# EAGLE design ESP-WROOM02-Breakout_v11 (EAGLE 7.7.0)
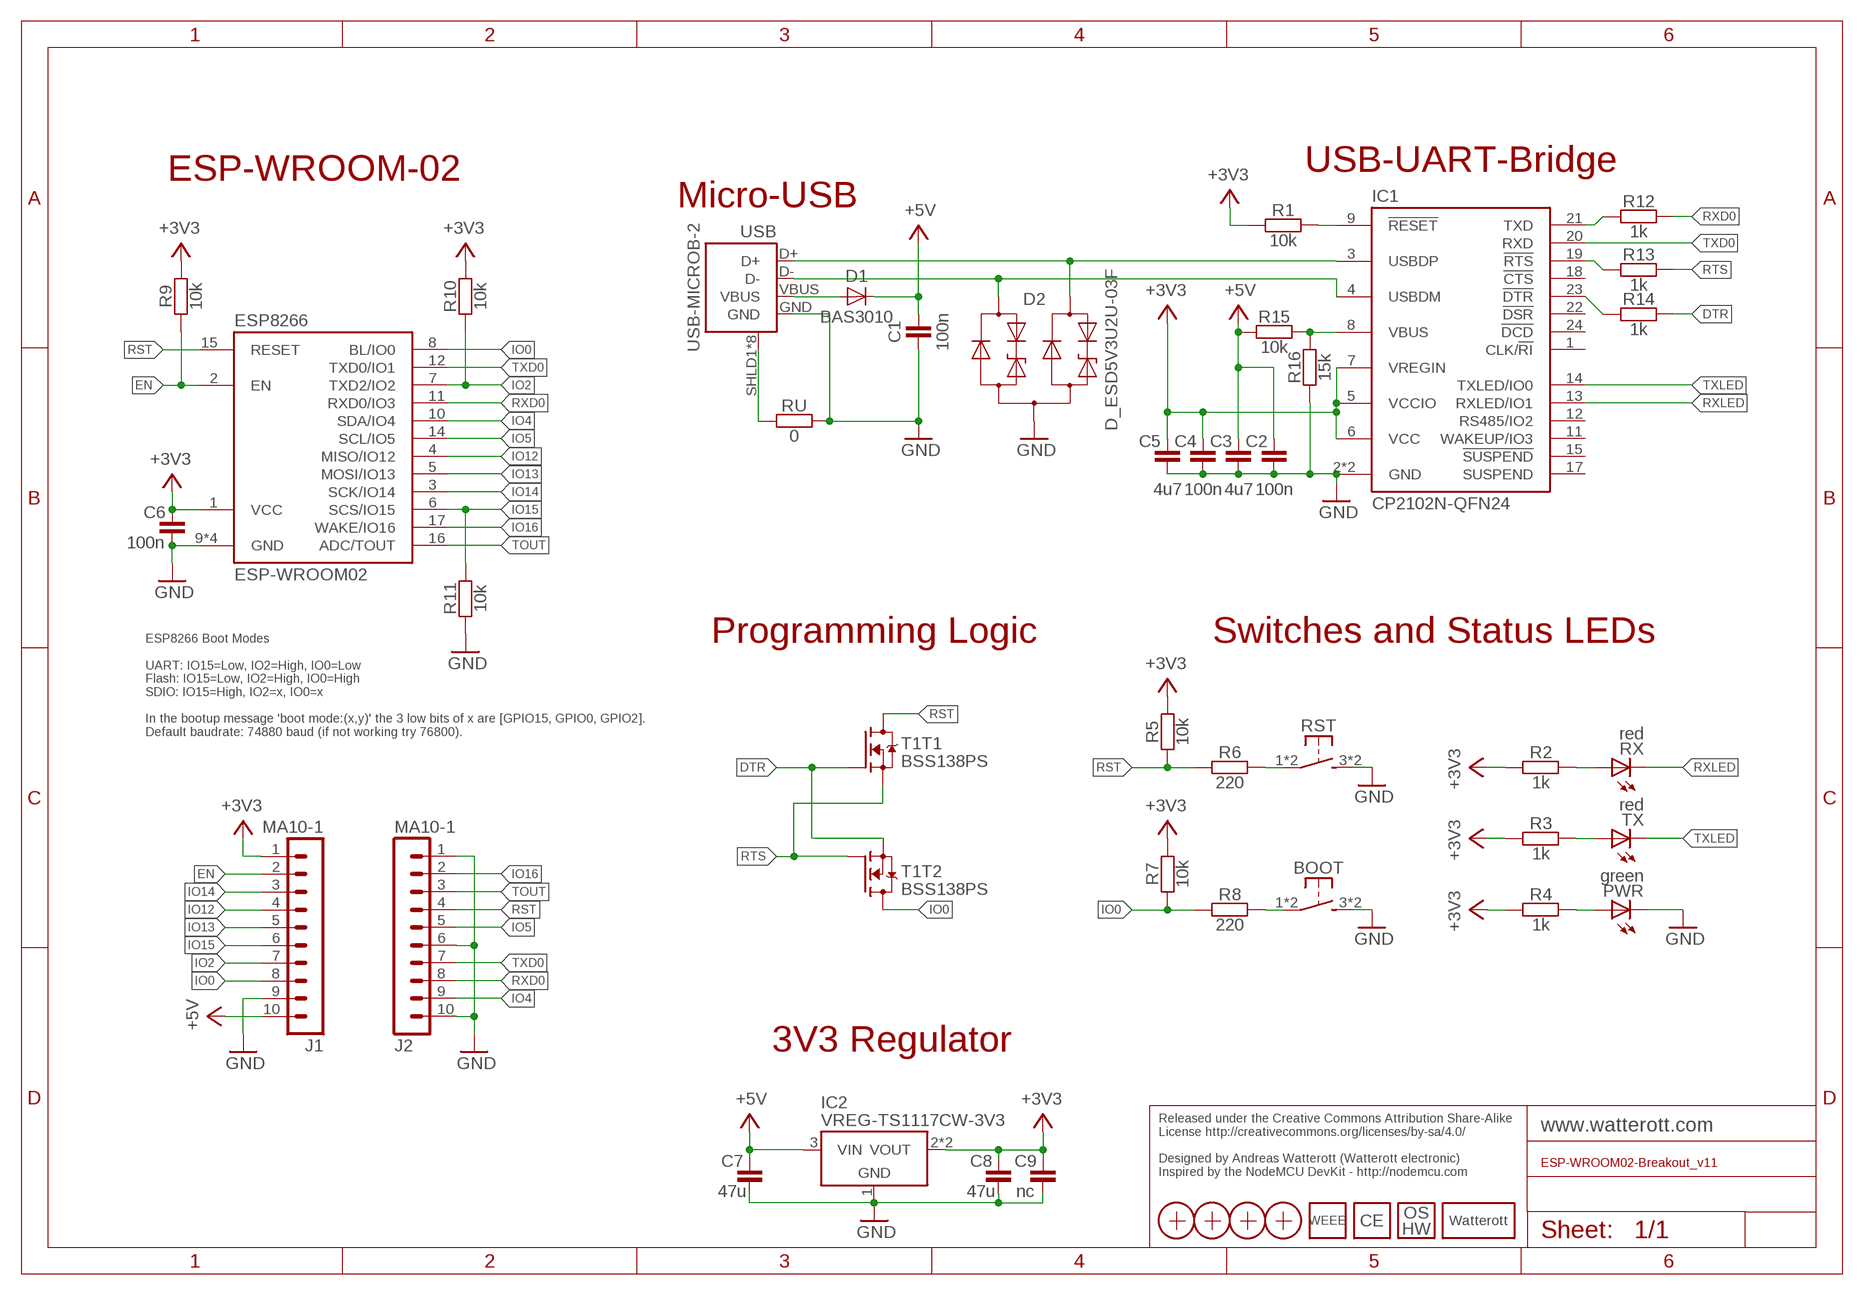
[diagram p0: schematic, sheet 1]

## Parts
BOOT  SW-TACTILE-PTS840P  [PTS840P]
C1  100n  CAPACITOR-0402  [C0402]
C2  100n  CAPACITOR-0402  [C0402]
C3  4u7  CAPACITOR-0603  [C0603]
C4  100n  CAPACITOR-0402  [C0402]
C5  4u7  CAPACITOR-0603  [C0603]
C6  100n  CAPACITOR-0402  [C0402]
C7  47u  CAPACITOR-1206  [C1206]
C8  47u  CAPACITOR-1206  [C1206]
C9  nc  CAPACITOR-1206  [C1206]
D1  BAS3010  DIODE-SOD323  [SOD323]
D2  D_ESD5V3U2U-03F  [SOT723]
ESP8266  ESP-WROOM02  [ESP-WROOM02]
IC1  CP2102N-QFN24  [QFN24-PAD]
IC2  VREG-TS1117CW-3V3  [SOT223]
J1  MA10-1  [MA10-1]
J2  MA10-1  [MA10-1]
LOGO1  LOGO_SPARK-4  [SPARK_4MM]
LOGO2  LOGO_OSHW-2  [OSHW_2MM]
LOGO3  LOGO_WEEE-4  [WEEE_4MM]
LOGO4  LOGO_CE-2  [CE_2MM]
PWR  green  LED-0603  [C0603]
R1  10k  RESISTOR-0402  [C0402]
R2  1k  RESISTOR-0402  [C0402]
R3  1k  RESISTOR-0402  [C0402]
R4  1k  RESISTOR-0402  [C0402]
R5  10k  RESISTOR-0402  [C0402]
R6  220  RESISTOR-0402  [C0402]
R7  10k  RESISTOR-0402  [C0402]
R8  220  RESISTOR-0402  [C0402]
R9  10k  RESISTOR-0402  [C0402]
R10  10k  RESISTOR-0402  [C0402]
R11  10k  RESISTOR-0402  [C0402]
R12  1k  RESISTOR-0402  [C0402]
R13  1k  RESISTOR-0402  [C0402]
R14  1k  RESISTOR-0402  [C0402]
R15  10k  RESISTOR-0402  [C0402]
R16  15k  RESISTOR-0402  [C0402]
RST  SW-TACTILE-PTS840P  [PTS840P]
RU  0  RESISTOR-0402  [C0402]
RX  red  LED-0603  [C0603]
T1  BSS138PS  [SOT363]
TX  red  LED-0603  [C0603]
USB  USB-MICROB-2  [USB-MICROB-10118194]
X1  PASSER-07  [PASSER_07MM]
X2  PASSER-07  [PASSER_07MM]
X3  PASSER-07  [PASSER_07MM]
X4  PASSER-07  [PASSER_07MM]

## Nets
+3V3: C4.2 C5.2 C6.2 C8.2 C9.2 ESP8266.1(VCC) IC1.5(VCCIO) IC1.6(VCC) IC1.7(VREGIN) IC2.2(VOUT) IC2.4(VOUT) J1.1 R1.1 R2.1 R3.1 R4.1 R5.2 R7.2 R9.2 R10.2
+5V: C1.2 C2.2 C3.2 C7.2 D1.C IC2.3(VIN) J1.10 R15.1
CP_VBUS: IC1.8(VBUS) R15.2 R16.2
CPDTR: IC1.23(!DTR) R14.1
CPRTS: IC1.19(!RTS) R13.1
CPTX: IC1.21(TXD) R12.1
D_N: D2.1(C1) IC1.4(USBDM) USB.D-
D_P: D2.2(C2) IC1.3(USBDP) USB.D+
DTR: R14.2 T1.2(T1:G) T1.4(T2:S)
EN: ESP8266.2(EN) J1.2 R9.1
GND: BOOT.3(S1) BOOT.4(S1) C1.1 C2.1 C3.1 C4.1 C5.1 C6.1 C7.1 C8.1 C9.1 D2.3(A) ESP8266.9(GND) ESP8266.13(GND) ESP8266.18(GND) ESP8266.TP(GND) IC1.2(GND) IC1.TP(GND) IC2.1(GND) J1.9 J2.1 J2.6 J2.10 PWR.C R11.1 R16.1 RST.3(S1) RST.4(S1) RU.2 USB.GND
IO0: ESP8266.8(BL/IO0) J1.8 R7.1 R8.1 T1.3(T2:D)
IO2: ESP8266.7(TXD2/IO2) J1.7 R10.1
IO4: ESP8266.10(SDA/IO4) J2.9
IO5: ESP8266.14(SCL/IO5) J2.5
IO12: ESP8266.4(MISO/IO12) J1.4
IO13: ESP8266.5(MOSI/IO13) J1.5
IO14: ESP8266.3(SCK/IO14) J1.3
IO15: ESP8266.6(SCS/IO15) J1.6 R11.2
IO16: ESP8266.17(WAKE/IO16) J2.2
N$1: R6.2 RST.1 RST.2(P1)
N$2: BOOT.1 BOOT.2(P1) R8.2
PWR-LED: PWR.A R4.2
RESET: IC1.9(!RESET) R1.2
RST: ESP8266.15(RESET) J2.4 R5.1 R6.1 T1.6(T1:D)
RTS: R13.2 T1.1(T1:S) T1.5(T2:G)
RX-LED: R2.2 RX.A
RXD0: ESP8266.11(RXD0/IO3) J2.8 R12.2
RXLED: IC1.13(RXLED/IO1) RX.C
SHLD: RU.1 USB.SHLD1(SHIELD) USB.SHLD2(SHIELD) USB.SHLD3(SHIELD) USB.SHLD4(SHIELD) USB.SHLD5(SHIELD) USB.SHLD6(SHIELD) USB.SHLD7(SHIELD) USB.SHLD8(SHIELD)
TOUT: ESP8266.16(ADC/TOUT) J2.3
TX-LED: R3.2 TX.A
TXD0: ESP8266.12(TXD0/IO1) IC1.20(RXD) J2.7
TXLED: IC1.14(TXLED/IO0) TX.C
VBUS: D1.A USB.VBUS
Unconnected: IC1.1(CLK/!RI) IC1.11(WAKEUP/IO3) IC1.12(RS485/IO2) IC1.15(!SUSPEND) IC1.17(SUSPEND) IC1.18(!CTS) IC1.22(!DSR) IC1.24(!DCD)

## Notes on the sheet
- ESP-WROOM-02 | USB-UART-Bridge
- Micro-USB
- ESP8266 Boot Modes
  
  UART: IO15=Low, IO2=High, IO0=Low
  Flash: IO15=Low, IO2=High, IO0=High
  SDIO: IO15=High, IO2=x, IO0=x
  
  In the bootup message 'boot mode:(x,y)' the 3 low bits of x are [GPIO15, GPIO0, GPIO2].
  Default baudrate: 74880 baud (if not working try 76800).
- Programming Logic | Switches and Status LEDs
- 3V3 Regulator
- Released under the Creative Commons Attribution Share-Alike
  License http://creativecommons.org/licenses/by-sa/4.0/
  
  Designed by Andreas Watterott (Watterott electronic)
  Inspired by the NodeMCU DevKit - http://nodemcu.com

## Library data of the parts
BOOT RST = we-switch:SW-TACTILE: Tactile Switche; DIGIKEY: CKN10511DKR-ND
C1-C9 = we-rcl:CAPACITOR: Capacitor ...2.2uF @ 6.3V -> 0402 ...4.7uF @ 6.3V -> 0603 ...10uF @ 16V -> 0805 ...22uF @ 25V -> 1206
D1 = we-rcl:DIODE: Diode
D2 = we-rcl:D_ESD5V3U2U: ESD5V3U2U TVS Diode (Uni-directional Ultra Low ESD) Vrwm=5.3V, 0.4pF@1MHz; DIGIKEY: ESD5V3U2U-03F H6327DKR-ND
ESP8266 = we-chip:ESP-WROOM02: Espressif ESP-WROOM-02 / AI-Thinker ESP-12 ESP8266 WiFi/WLAN Module
IC1 = we-chip:CP2102N: Silabs CP2102N USB to UART Bridge (5V tolerant inputs) CP2102N-QFN24 is pin-compatible with CP2104.
IC2 = we-power:VREG: Voltage Regulator LDOs Taiwan Semi TS1117 800mA max 15V - compatible On Semi NCP1117 1A max 20V - compatible Diodes AP2111H 0.6A max 6V (0.25V@0.6A) - compatible Diodes AP2114H 1A max 6V (0.45V@1A) Taiwan Semi TS9011 250mA max 12V - compatible Diodes AP2210 300mA max 15V - compatible Microchip MCP1700 250mA max 6.5V - compatible Microchip MCP1702 250mA max 13V - compatible Microchip MCP1703 250mA max 16V - compatible Microchip MCP1754 150mA max 16V Taiwan Semi TS5204 80mA max 16V (low noise) DC/DC Converter Modules Recom R-78Ex.x-1.0-W36 1A max 28V - compatible CUI V78xx-2000 2A max 18V Murata OKI-78SR-x.x/1.5-W36 1.5A max 36V
J1 J2 = we-con:MA10-1: Pin Header
LOGO1 = we-symbol:LOGO_SPARK: Watterott electronic Logo
LOGO2 = we-symbol:LOGO_OSHW: Open-Source-Hardware Logo
LOGO3 = we-symbol:LOGO_WEEE: WEEE Logo
LOGO4 = we-symbol:LOGO_CE: CE Logo
PWR RX TX = we-opto:LED: LED red, green, blue -> 0603
R1-R16 RU = we-rcl:RESISTOR: Resistor all kinds in 0402 and 0603
T1 = we-transistor:BSS138PS: BSS138 Dual N-Channel MOSFET (Vgs>=+/-20V, Vds>=40V, Id>=0.2A + Rds<=3Ohm @ Vgs=4.5V) BSS138PS compatible: 2N7002PS, Si1926DL, BSS138BKS (with ESD protection)
USB = we-con:USB: USB Connector; DIGIKEY: 609-4618-6-ND
X1-X4 = we-symbol:PASSER: Fiducial Marker

## Board
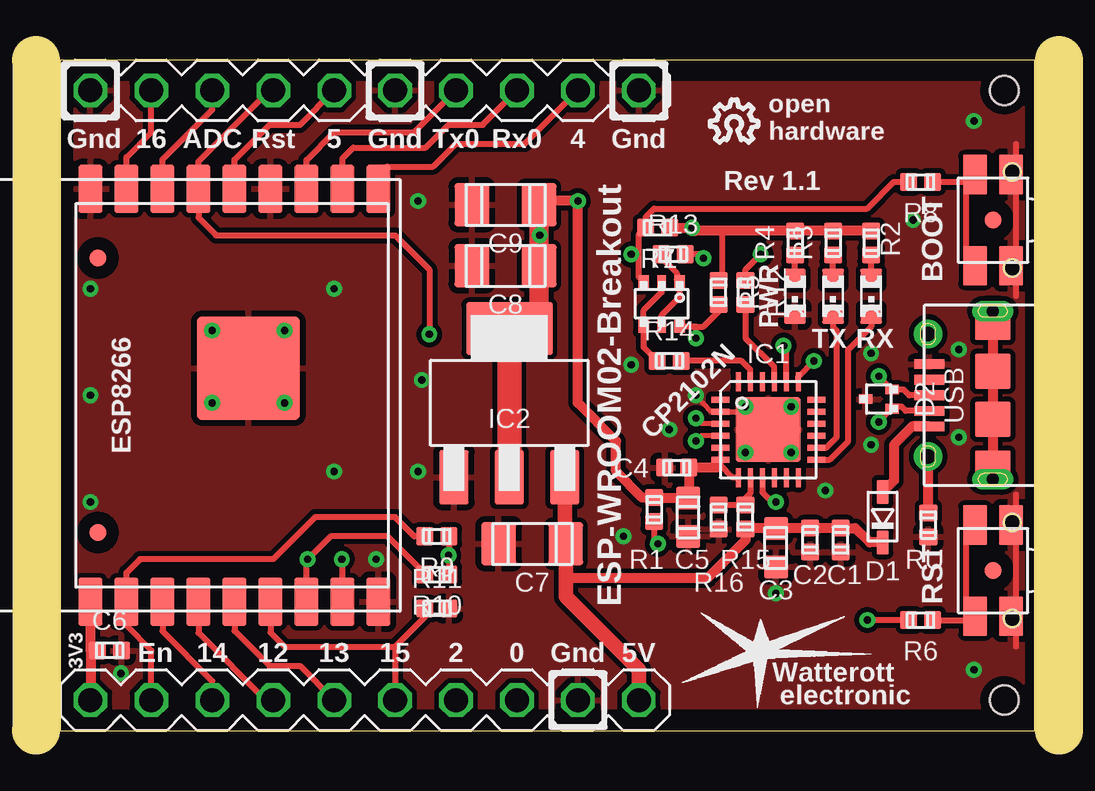
[diagram p1: board, top side]
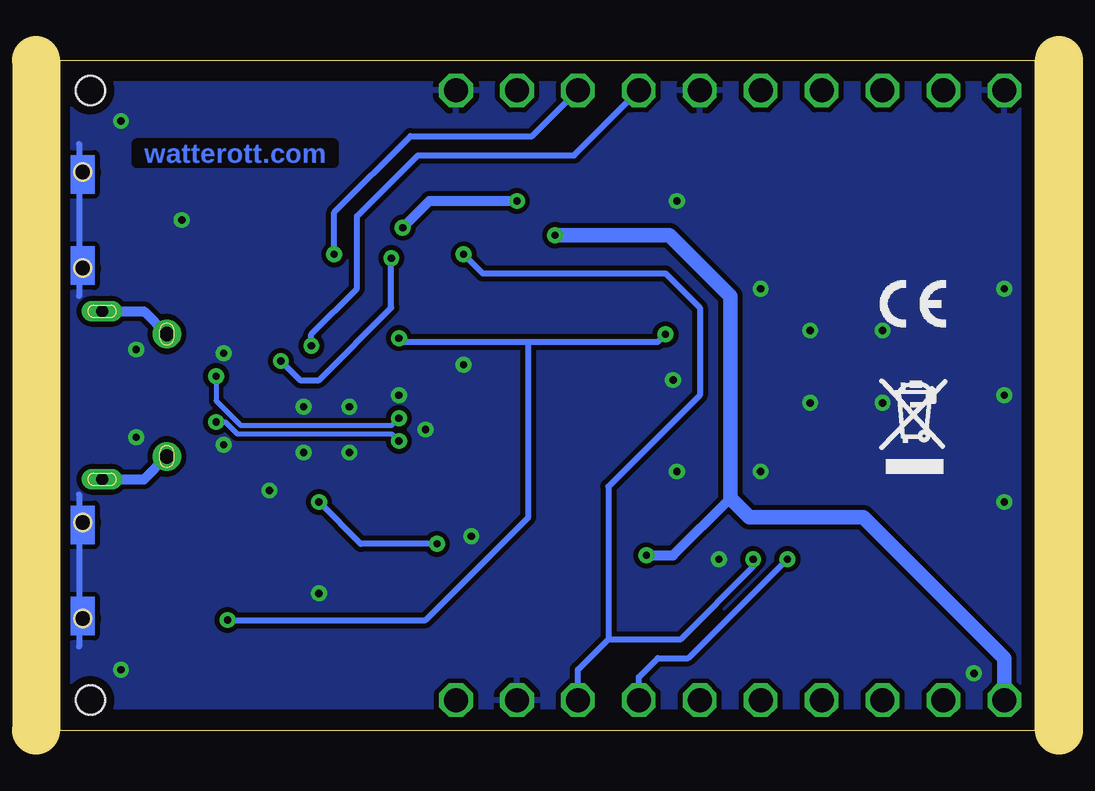
[diagram p2: board, bottom side, seen from below]

Size 40.64 x 27.94 mm. Coordinates in mm from the lower left corner, seen from the top.
Outline: 0,0 40.64,0 40.64,27.94 0,27.94 0,0
Copper layers (1*16): Top 0.035mm / dielectric 1.5mm / Bottom 0.035mm
Design rules "we-dru-2-layer *": minimum track width 0.15mm, minimum drill 0.3mm, track to track 0.15mm, track to pad 0.15mm, pad to pad 0.15mm, via to via 0.15mm, smd to smd 0.1mm, copper to edge 0.4mm, drill to drill 0.2mm, minimum pad ring 0.18mm, minimum via ring 0.18mm, stop-mask expansion 0.1mm, vias tented up to drill 0.5mm, thermal gap 0.25mm
Holes 1.2 mm at 39.37,26.67 39.37,1.27
Milling: 2 lines

### Footprints (pad centres in the part's own frame; a part is rotated, then mirrored left to right if it is on the bottom)
PTS840P = smd 1.65 x 1: 1 -1.9,0.75; 2 1.9,0.75; 3 -1.9,-0.75; 4 1.9,-0.75 | hole 0.7: -2,-0.8; 2,-0.8
C0402 = smd 0.75 x 0.7: 1 0,0.5; 2 0,-0.5
C0603 = smd 1 x 0.95: 1 0,0.8; 2 0,-0.8
C1206 = smd 1.8 x 1.45: 1 0,1.4; 2 0,-1.4
SOD323 = smd 0.5 x 1: A 0,-1.05; C 0,1.05
SOT723 = smd 0.6 x 0.4: 1 -0.55,0.4; 2 -0.55,-0.4; 3 0.55,0
ESP-WROOM02 = smd 2 x 1: 1 -8.6,1.9; 2 -8.6,0.4; 3 -8.6,-1.1; 4 -8.6,-2.6; 5 -8.6,-4.1; 6 -8.6,-5.6; 7 -8.6,-7.1; 8 -8.6,-8.6; 9 -8.6,-10.1; 10 8.6,-10.1; 11 8.6,-8.6; 12 8.6,-7.1; 13 8.6,-5.6; 14 8.6,-4.1; 15 8.6,-2.6; 16 8.6,-1.1; 17 8.6,0.4; 18 8.6,1.9 | smd 4.3 x 4.3: TP 1.12,-4.68
QFN24-PAD = smd 0.8 x 0.26: 1 -2,1.25; 2 -2,0.75; 3 -2,0.25; 4 -2,-0.25; 5 -2,-0.75; 6 -2,-1.25; 13 2,-1.25; 14 2,-0.75; 15 2,-0.25; 16 2,0.25; 17 2,0.75; 18 2,1.25 | smd 0.26 x 0.8: 7 -1.25,-2; 8 -0.75,-2; 9 -0.25,-2; 10 0.25,-2; 11 0.75,-2; 12 1.25,-2; 19 1.25,2; 20 0.75,2; 21 0.25,2; 22 -0.25,2; 23 -0.75,2; 24 -1.25,2 | smd 2.7 x 2.7: TP 0,0
SOT223 = smd 2.235 x 1.219: 1 -3.099,2.311; 2 -3.099,0; 3 -3.099,-2.311 | smd 2.2 x 3.6: 4 3.099,0
MA10-1 = drill 1 octagon: 1 0,11.43; 2 0,8.89; 3 0,6.35; 4 0,3.81; 5 0,1.27; 6 0,-1.27; 7 0,-3.81; 8 0,-6.35; 9 0,-8.89; 10 0,-11.43
C0603' = smd 0.9 x 0.8: A 0,-0.75; C 0,0.75
SOT363 = smd 0.6 x 0.5: 1 -0.9,0.75; 3 -0.9,-0.75; 4 0.9,-0.75; 6 0.9,0.75 | smd 0.6 x 0.4: 2 -0.9,0; 5 0.9,0
USB-MICROB-10118194 = smd 1.3 x 0.4: D+ -2.5,0; D- -2.5,-0.65; GND -2.5,1.3; ID -2.5,0.65; VBUS -2.5,-1.3 | drill 0.6 pad 1.2: SHLD1 -2.55,2.55; SHLD2 -2.55,-2.55 | drill 0.5 pad 0.8 long: SHLD3 0.15,3.5; SHLD4 0.15,-3.5 | smd 1.5 x 1.1: SHLD5 0.15,2.85; SHLD6 0.15,-2.85 | smd 1.5 x 1.5: SHLD7 0.15,1; SHLD8 0.15,-1
PASSER_07MM = smd 0.7 x 0.7: X 0,0

### Placement (x,y rotation side)
BOOT  38.89,21.27 90 top
C1  32.54,7.94 180 top
C2  31.27,7.94 180 top
C3  29.84,7.62 180 top
C4  25.72,10.95 90 top
C5  26.19,8.89 180 top
C6  2.06,3.33 270 top
C7  19.68,7.78 90 top
C8  18.57,19.37 90 top
C9  18.57,21.91 90 top
D1  34.29,8.89 180 top
D2  34.13,13.81 180 top
ESP8266  3.17,13.97 90 top
IC1  29.53,12.54 0 top
IC2  18.73,13.65 90 top
J1  12.7,1.27 90 top
J2  12.7,26.67 90 top
LOGO1  29.21,3.33 0 top
LOGO2  28.1,25.4 0 top
LOGO3  5.08,12.7 0 bottom
LOGO4  5.08,17.78 0 bottom
PWR  green  [C0603']  30.64,18.1 180 top
R1  24.77,9.21 0 top
R2  33.81,20.32 0 top
R3  32.23,20.32 0 top
R4  30.64,20.32 0 top
R5  27.46,18.26 180 top
R6  35.88,4.6 90 top
R7  24.92,20.95 90 top
R8  35.88,22.86 90 top
R9  15.72,8.1 90 top
R10  15.72,6.51 90 top
R11  15.72,5.08 270 top
R12  28.57,18.26 180 top
R13  25.56,19.84 270 top
R14  25.4,15.4 270 top
R15  28.57,8.89 180 top
R16  27.46,8.89 180 top
RST  38.89,6.67 90 top
RU  36.2,8.57 0 top
RX  red  [C0603']  33.81,18.1 180 top
T1  25.08,17.78 270 top
TX  red  [C0603']  32.23,18.1 180 top
USB  38.73,13.97 0 top
X1  1.59,19.68 180 top
X2  1.59,8.26 180 top
X3  38.89,21.27 0 top
X4  38.89,6.67 0 top

### Tracks (layer width: path | path; a pad name or v marks a point on that pad's centre or on a via)
+3V3  (via drill 0.3)
  Top 0.203: 26.22,9.71 C5.2 26.18,9.71 | IC1.5 IC1.6
  Top 0.254: 27.32,11.29 IC1.6 27.53,11.11 | IC1.7 28.04,10.54 27.53,11.05 27.53,11.11 | 27.37,10.95 27.53,11.11 | R5.2 27.49,18.76 27.62,18.89 27.62,20.82 | C9.2 19.97,21.94 19.84,22.07 | R9.2 16.22,7.3 R10.2
  Top 0.406: R2.1 R3.1 R4.1 27.62,20.82 26.49,20.82 v26.35,20.95 R7.2 | 27.37,10.95 C4.2 26.22,9.71 | 26.18,9.71 R1.1 24.27,9.71 23.18,10.79 23.18,12.06 21.59,13.65 v21.59,22.07 19.84,22.07 | 1.27,3.33 ESP8266.1 | C6.2 1.27,3.33 | v16.19,7.3 16.22,7.3 | 1.27,3.33 J1.1
  Top 0.61: 19.97,17.12 19.68,16.83 18.81,16.83 IC2.4 | v20,20.64 19.97,20.64
  Top 0.813: C9.2 19.97,20.64 C8.2 19.97,17.12
  Top 1.016: IC2.2 IC2.4
  Bottom 0.406: v26.35,20.95 25.24,22.07 v21.59,22.07 | v16.19,7.3 15.08,7.3 12.7,9.68
  Bottom 0.61: J1.1 1.27,3.02 7.14,8.89 11.91,8.89 12.7,9.68 12.7,18.1 15.24,20.64 v20,20.64
+5V
  Top 0.406: 21.09,6.35 26.99,6.35 28.57,7.94 R15.1 28.62,8.44 | 29.69,8.44 C2.2 C1.2 33.16,8.44 33.75,7.84 D1.C | 29.69,8.44 28.62,8.44 | 28.62,8.44 28.6,8.44 28.57,8.41 28.73,8.41 | C3.2 29.7,8.42 29.69,8.44
  Top 0.61: IC2.3 21.04,7.82 C7.2 21.09,6.35 21.09,5.58 24.13,2.54 J1.10
CP_VBUS
  Top 0.254: IC1.8 28.78,9.89 28.57,9.68 R15.2 R16.2
CPDTR
  Top 0.254: IC1.23 28.78,15.04 28.42,15.4 R14.1
CPRTS  (via drill 0.3)
  Top 0.254: IC1.19 30.78,14.74 v31.43,15.4 | v26.83,19.68 26.67,19.84 R13.1
  Bottom 0.254: v31.43,15.4 30.64,14.61 29.84,14.61 26.83,17.62 v26.83,19.68
CPTX
  Top 0.254: IC1.21 29.78,15.15 28.57,16.35 R12.1
D_N  (via drill 0.3)
  Top 0.15: 34.76,13.49 D2.1
  Top 0.16: D2.1
  Top 0.203: IC1.4 26.74,12.29 v26.51,12.06 | D2.1 | D2.1 v34.13,12.86
  Top 0.254: USB.D- 35.26,13.32 35.08,13.49 34.76,13.49
  Bottom 0.203: v34.13,12.86 33.75,12.86 33.25,12.37 26.81,12.37 v26.51,12.06
D_P  (via drill 0.3)
  Top 0.203: IC1.3 26.74,12.79 v26.51,13.02 | D2.2 v34.13,14.76
  Top 0.254: USB.D+ 35.4,13.97 35.16,14.21 D2.2
  Bottom 0.203: v34.13,14.76 34.13,13.74 33.11,12.72 26.81,12.72 v26.51,13.02
DTR
  Top 0.254: T1.2 25.08,18.26 24.33,17.51 T1.4 24.33,15.97 R14.2
EN
  Top 0.254: J1.2 3.81,3.33 2.77,4.37 ESP8266.2 2.77,6.58 3.33,7.14 8.89,7.14 10.64,8.89 13.97,8.89 14.76,8.1 R9.1
GND  (via drill 0.3)
  Top 0.203: IC1.TP 28.78,13.29 IC1.2 27.16,13.29 26.8,13.65
  Top 0.254: 39.85,24.45 39.85,19.37 | 39.85,19.37 39.85,18.1 | 39.85,9.84 39.85,4.76 | 39.85,4.76 39.85,3.49 | RST.3 39.84,4.77 39.85,4.76 | BOOT.3 39.84,19.37 39.85,19.37
  Bottom 0.254: 39.85,9.84 39.85,3.49 | 39.85,24.45 39.85,18.1
  other vias: 30.48,11.59 28.57,11.59 30.48,13.49 28.57,13.49 26.51,13.97 33.81,11.91 33.81,15.72 1.27,18.41 1.27,9.53 1.27,13.97 37.47,15.88 37.47,12.22 35.56,21.27 25.4,12.54 6.35,13.65 9.37,13.65 6.35,16.67 9.37,16.67 14.92,10.79 15.08,14.61 29.84,5.71 38.1,25.4 23.81,15.24 2.54,2.38 13.18,7.14 11.43,18.41 11.43,10.79 14.92,22.07 23.5,8.1 38.1,2.54 31.91,10
  pour Top (isolate 0.203, rank 2): 0.64,26.99 40.48,26.99 40.48,0.95 0.64,0.95
  pour Bottom (isolate 0.203): 0.64,26.99 40.48,26.99 40.48,0.95 0.64,0.95
IO0  (via drill 0.3)
  Top 0.254: R8.1 34.77,22.86 33.66,21.75 24.77,21.75 24.42,21.41 R7.1 24.13,20.66 24.13,19.84 | ESP8266.8 11.78,7.12 v11.75,7.14 | T1.3 24.13,18.89 24.13,19.84 | v23.81,19.84 24.13,19.84
  Bottom 0.254: J1.8 19.05,2.54 17.78,3.81 | 17.78,3.81 14.76,3.81 11.75,6.83 v11.75,7.14 | v23.81,19.84 23.02,19.05 15.4,19.05 13.97,17.62 13.97,13.97 17.78,10.16 17.78,3.81
IO2  (via drill 0.3)
  Top 0.254: ESP8266.7 10.28,7.1 v10.32,7.14 11.27,8.1 13.65,8.1 15.24,6.51 R10.1
  Bottom 0.254: J1.7 16.51,2.22 15.72,3.02 14.45,3.02 v10.32,7.14
IO4
  Top 0.254: ESP8266.10 13.28,23.12 13.65,23.5 15.56,23.5 16.51,24.45 19.37,24.45 J2.9
IO5
  Top 0.254: ESP8266.14 7.28,23.79 8.73,25.24 10,25.24 J2.5
IO12
  Top 0.254: ESP8266.4 5.78,4.07 8.57,1.27 J1.4
IO13
  Top 0.254: ESP8266.5 7.28,4.16 8.73,2.7 10,2.7 J1.5
IO14
  Top 0.254: J1.3 6.35,2.06 4.28,4.14 ESP8266.3
IO15
  Top 0.254: R11.2 15.22,4.74 13.97,3.49 | 13.97,3.49 J1.6 | ESP8266.6 8.78,4.08 9.37,3.49 13.97,3.49
IO16
  Top 0.254: ESP8266.17 2.77,23.89 3.81,24.92 J2.2
N$1
  Top 0.254: RST.2 37.78,8.21 37.78,5.24 38.14,4.88 RST.1 37.98,4.6 R6.2
N$2
  Top 0.254: BOOT.1 38.14,19.48 37.78,19.84 37.78,22.81 | 37.78,22.81 BOOT.2 | R8.2 37.73,22.86 37.78,22.81
PWR-LED
  Top 0.254: PWR.A R4.2
RESET  (via drill 0.3)
  Top 0.254: R1.2 24.77,7.94 v24.92,7.78 | IC1.9 29.28,9.93 29.69,9.53 v29.84,9.53
  Bottom 0.254: v24.92,7.78 28.1,7.78 v29.84,9.53
RST  (via drill 0.3)
  Top 0.254: R6.1 v33.66,4.6 | v26.51,16.35 26.51,16.83 | 26.51,16.83 25.89,16.83 | J2.4 8.73,26.67 5.78,23.71 ESP8266.15 5.78,21.37 6.51,20.64 13.97,20.64 15.4,19.21 v15.4,16.51 | 26.51,16.83 26.83,16.83 27.46,17.46 R5.1
  Top 0.406: 25.89,16.83 T1.6
  Bottom 0.254: v33.66,4.6 25.4,4.6 21.11,8.89 21.11,16.19 | 21.11,16.19 15.72,16.19 v15.4,16.51 | v26.51,16.35 26.35,16.19 21.11,16.19
RTS
  Top 0.254: T1.5 25.08,17.3 25.83,18.05 T1.1 | 25.88,18.72 T1.1 | R13.2 25.06,19.71 25.72,19.05 25.72,18.8 T1.1
RX-LED
  Top 0.254: RX.A R2.2
RXD0  (via drill 0.3)
  Top 0.254: R12.2 28.57,19.21 v29.21,19.84 | ESP8266.11 11.78,23.84 12.22,24.29 15.24,24.29 16.19,25.24 17.62,25.24 J2.8
  Bottom 0.254: v29.21,19.84 29.21,21.59 26.04,24.77 20.95,24.77 J2.8
RXLED
  Top 0.254: IC1.13 32.09,11.29 32.86,12.06 32.86,15.88 33.81,16.83 RX.C
SHLD
  Top 0.406: USB.SHLD3 USB.SHLD5 USB.SHLD7 USB.SHLD8 USB.SHLD6 USB.SHLD4 | RU.1 USB.SHLD2
  Bottom 0.406: USB.SHLD2 37.13,10.47 USB.SHLD4 | USB.SHLD3 37.13,17.47 USB.SHLD1
TOUT
  Top 0.254: ESP8266.16 4.28,23.8 6.35,25.88 J2.3
TX-LED
  Top 0.254: TX.A R3.2
TXD0  (via drill 0.3)
  Top 0.254: IC1.20 30.28,15.92 v30.16,16.03 | ESP8266.12 10.28,23.77 11.43,24.92 14.76,24.92 J2.7
  Bottom 0.254: v30.16,16.03 30.16,16.51 28.26,18.41 28.26,21.43 25.72,23.97 19.21,23.97 J2.7
TXLED
  Top 0.254: IC1.14 31.95,11.79 32.38,12.22 32.38,16.67 32.23,16.83 TX.C
VBUS
  Top 0.406: USB.VBUS 35.53,12.67 34.77,11.91 34.77,10.42 D1.A

### Text on the board
Bottom: watterott.com
tPlace: open / hardware | Gnd | 16 | ADC | Rst | 5 | Gnd | Tx0 | Rx0 | 4 | Gnd | Rev 1.1 | ESP-WROOM02-Breakout | CP2102N | 3V3 | En | 14 | 12 | 13 | 15 | 2 | 0 | Gnd | 5V | Watterott | electronic
Reference: Silkscreen: 21 tPlace + 22 bPlace